# EAGLE design Jalousie_02 (EAGLE 4.16)
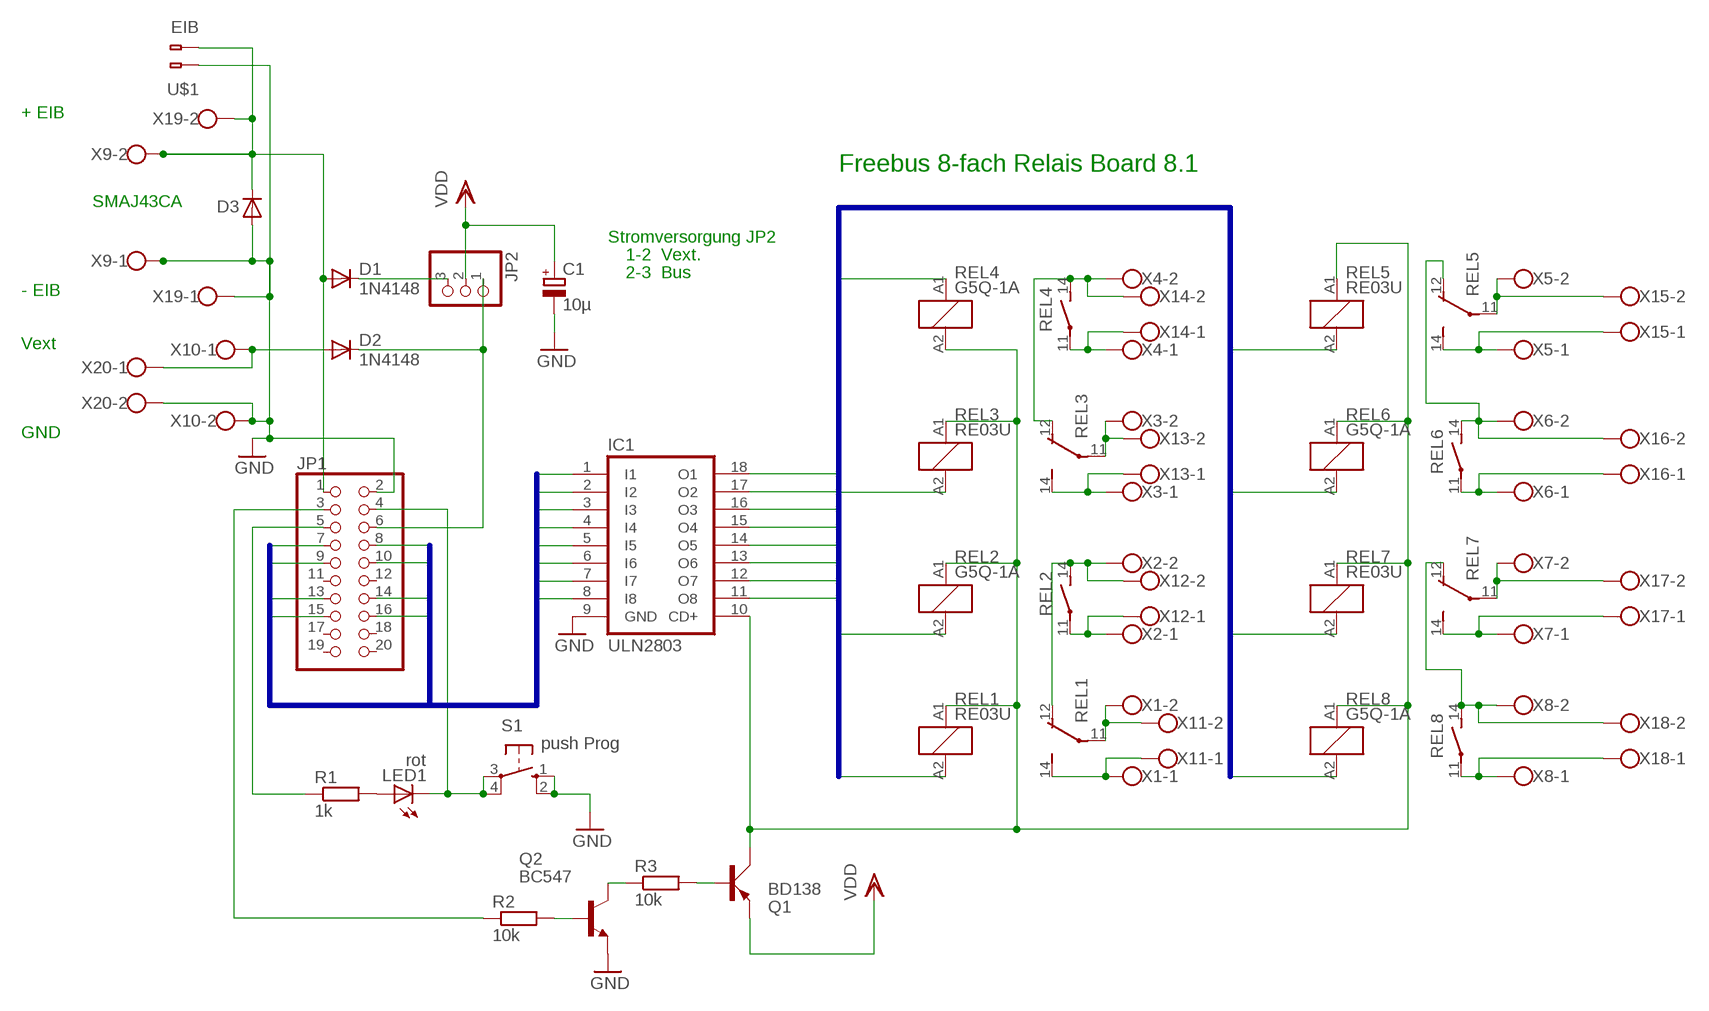
[diagram p0: schematic, sheet 1]

## Parts
C1  10µ  CPOL-EUE3.5-8  [E3,5-8]
D1  1N4148  [DO35-10]
D2  1N4148  [DO35-10]
D3  D-  [SMA]
IC1  ULN2803  ULN2803A  [DIL18]
JP1  PINHD-2X10  [2X10]
JP2  PINHD-1X3  [1X03]
LED1  rot  LED3MM  [LED3MM]
Q1  BD138  BD140  [TO126AV]
Q2  BC547  [TO92]
R1  1k  R-EU_0207/10  [0207/10]
R2  10k  R-EU_0207/10  [0207/10]
R3  10k  R-EU_0207/10  [0207/10]
REL1  RE03U  [G5Q_1_EU]
REL2  G5Q-1A  RE030024  [RE-SCHRACK]
REL3  RE03U  [G5Q_1_EU]
REL4  G5Q-1A  RE030024  [RE-SCHRACK]
REL5  RE03U  [G5Q_1_EU]
REL6  G5Q-1A  RE030024  [RE-SCHRACK]
REL7  RE03U  [G5Q_1_EU]
REL8  G5Q-1A  RE030024  [RE-SCHRACK]
S1  push Prog  10-XX  [B3F-10XX]
U$1  EIB  [BUSKLEMME243-724]
X1  W237-102W2POL5_08  [W237-132]
X2  W237-102W2POL5_08  [W237-132]
X3  W237-102W2POL5_08  [W237-132]
X4  W237-102W2POL5_08  [W237-132]
X5  W237-102W2POL5_08  [W237-132]
X6  W237-102W2POL5_08  [W237-132]
X7  W237-102W2POL5_08  [W237-132]
X8  W237-102W2POL5_08  [W237-132]
X9  W237-102W2POL5_08  [W237-132]
X10  W237-102W2POL5_08  [W237-132]
X11  W237-102AKL007-2P  [AKL007-02]
X12  W237-102AKL007-2P  [AKL007-02]
X13  W237-102AKL007-2P  [AKL007-02]
X14  W237-102AKL007-2P  [AKL007-02]
X15  W237-102AKL007-2P  [AKL007-02]
X16  W237-102AKL007-2P  [AKL007-02]
X17  W237-102AKL007-2P  [AKL007-02]
X18  W237-102AKL007-2P  [AKL007-02]
X19  W237-102AKL007-2P  [AKL007-02]
X20  W237-102AKL007-2P  [AKL007-02]

## Nets
GND: C1.- D3.2(A) IC1.9(GND) JP1.2 Q2.1(E) S1.1(S) S1.2(S1) U$1.1(B-1) X9.1 X10.2 X19.1 X20.2
IO1: IC1.1(I1) JP1.16
IO2: IC1.2(I2) JP1.15
IO3: IC1.3(I3) JP1.14
IO4: IC1.4(I4) JP1.13
IO5: IC1.5(I5) JP1.10
IO6: IC1.6(I6) JP1.9
IO7: IC1.7(I7) JP1.8
IO8: IC1.8(I8) JP1.7
N$1: REL4.11(2:P) X4.1 X14.1
N$2: REL3.12(14:O) REL4.14(2:S) X4.2 X14.2
N$3: REL3.14(14:S) X3.1 X13.1
N$4: REL3.11(14:P) X3.2 X13.2
N$5: REL2.11(2:P) X2.1 X12.1
N$6: REL1.12(14:O) REL2.14(2:S) X2.2 X12.2
N$7: REL1.14(14:S) X1.1 X11.1
N$8: REL1.11(14:P) X1.2 X11.2
N$9: REL5.12(14:O) REL6.14(2:S) X6.2 X16.2
N$10: REL6.11(2:P) X6.1 X16.1
N$11: REL7.11(14:P) X7.2 X17.2
N$12: REL8.11(2:P) X8.1 X18.1
N$13: REL5.11(14:P) X5.2 X15.2
N$14: REL5.14(14:S) X5.1 X15.1
N$15: REL7.14(14:S) X7.1 X17.1
N$16: REL7.12(14:O) REL8.14(2:S) X8.2 X18.2
N$17: D2.A X10.1 X20.1
N$19: IC1.10(CD+) Q1.C REL1.A1 REL2.A1 REL3.A1 REL4.A2 REL5.A1 REL6.A1 REL7.A1 REL8.A1
N$20: D1.A D3.1(C) JP1.1 U$1.2(B-2) X9.2 X19.2
N$24: JP1.5 R1.1
N$27: JP1.4 LED1.K(C) S1.3(P) S1.4(P1)
N$28: LED1.A R1.2
N$31: D2.C JP1.6 JP2.1
N$32: D1.C JP2.3
N$33: JP1.3 R2.1
N$37: Q1.B R3.2
N$38: Q2.3(C) R3.1
N$39: Q2.2(B) R2.2
R1: IC1.14(O5) REL4.A1
R2: IC1.13(O6) REL3.A2
R3: IC1.12(O7) REL2.A2
R4: IC1.11(O8) REL1.A2
R5: IC1.15(O4) REL5.A2
R6: IC1.16(O3) REL6.A2
R7: IC1.17(O2) REL7.A2
R8: IC1.18(O1) REL8.A2
VDD: C1.+ JP2.2 Q1.E
Unconnected: JP1.11 JP1.12 JP1.17 JP1.18 JP1.19 JP1.20

## Buses
R[1..8]
IO[1..8]

## Notes on the sheet
- + EIB
- Freebus 8-fach Relais Board 8.1
- SMAJ43CA
- Stromversorgung JP2
- 1-2  Vext.
- 2-3  Bus
- - EIB
- Vext
- GND

## Library data of the parts
C1 = rcl:CPOL-EU: POLARIZED CAPACITOR, European symbol
D1 D2 = diode:1N4148: DIODE high speed (Philips)
D3 = semicon-smd-ipc:D-: DIODE unfilled
IC1 = uln-udn:ULN2803A: DRIVER ARRAY
JP1 = pinhead:PINHD-2X10: PIN HEADER
JP2 = pinhead:PINHD-1X3: PIN HEADER
LED1 = led:LED: LED OSRAM: - CHIPLED LG R971, LG N971, LY N971, LG Q971, LY Q971, LO R971, LY R971 LH N974, LH R974 LS Q976, LO Q976, LY Q976 LO Q996 - Hyper CHIPLED LW Q18S LB Q993, LB Q99A, LB R99A - SideLED LS A670, LO A670, LY A670, LG A670, LP A670 LB A673, LV A673, LT A673, LW A673 LH A674 LY A675 LS A676, LA A676, LO A676, LY A676, LW A676 LS A679, LY A679, LG A679 - Hyper Micro SIDELED® LS Y876, LA Y876, LO Y876, LY Y876 LT Y87S - SmartLED LW L88C, LW L88S LB L89C, LB L89S, LG L890 LS L89K, LO L89K, LY L89K LS L896, LA L896, LO L896, LY L896 - TOPLED LS T670, LO T670, LY T670, LG T670, LP T670 LSG T670, LSP T670, LSY T670, LOP T670, LYG T670 LG T671, LOG T671, LSG T671 LB T673, LV T673, LT T673, LW T673 LH T674 LS T676, LA T676, LO T676, LY T676, LB T676, LH T676, LSB T676, LW T676 LB T67C, LV T67C, LT T67C, LS T67K, LO T67K, LY T67K, LW E67C LS E67B, LA E67B, LO E67B, LY E67B, LB E67C, LV E67C, LT E67C LW T67C LS T679, LY T679, LG T679 LS T770, LO T770, LY T770, LG T770, LP T770 LB T773, LV T773, LT T773, LW T773 LH T774 LS E675, LA E675, LY E675, LS T675 LS T776, LA T776, LO T776, LY T776, LB T776 LHGB T686 LT T68C, LB T68C - Hyper Mini TOPLED® LB M676 - Mini TOPLED Santana® LG M470 LS M47K, LO M47K, LY M47K Source: http://www.osram.convergy.de - LUMILED® LXK2-PW12-R00, LXK2-PW12-S00, LXK2-PW14-U00, LXK2-PW14-V00 LXK2-PM12-R00, LXK2-PM12-S00, LXK2-PM14-U00 LXK2-PE12-Q00, LXK2-PE12-R00, LXK2-PE12-S00, LXK2-PE14-T00, LXK2-PE14-U00 LXK2-PB12-K00, LXK2-PB12-L00, LXK2-PB12-M00, LXK2-PB14-N00, LXK2-PB14-P00, LXK2-PB14-Q00 LXK2-PR12-L00, LXK2-PR12-M00, LXK2-PR14-Q00, LXK2-PR14-R00 LXK2-PD12-Q00, LXK2-PD12-R00, LXK2-PD12-S00 LXK2-PH12-R00, LXK2-PH12-S00 LXK2-PL12-P00, LXK2-PL12-Q00, LXK2-PL12-R00 Source: www.luxeon.com
Q1 = transistor-power:BD140: PNP TRANSISTOR
Q2 = transistor-npn:BC547*: NPN Transistor
R1-R3 = rcl:R-EU_: RESISTOR, European symbol
REL1 REL3 REL5 REL7 = freebus_relay:RE03U
REL2 REL4 REL6 REL8 = relay:RE03*: Miniature PCB Relay 1 pole 6 A SCHRACK Source: http://www.schrack.com/.. 5812.pdf
S1 = switch-omron:10-XX: OMRON SWITCH
U$1 = con-wago:EIB
X1-X20 = con-wago-500:W237-102: WAGO SCREW CLAMP

## Board
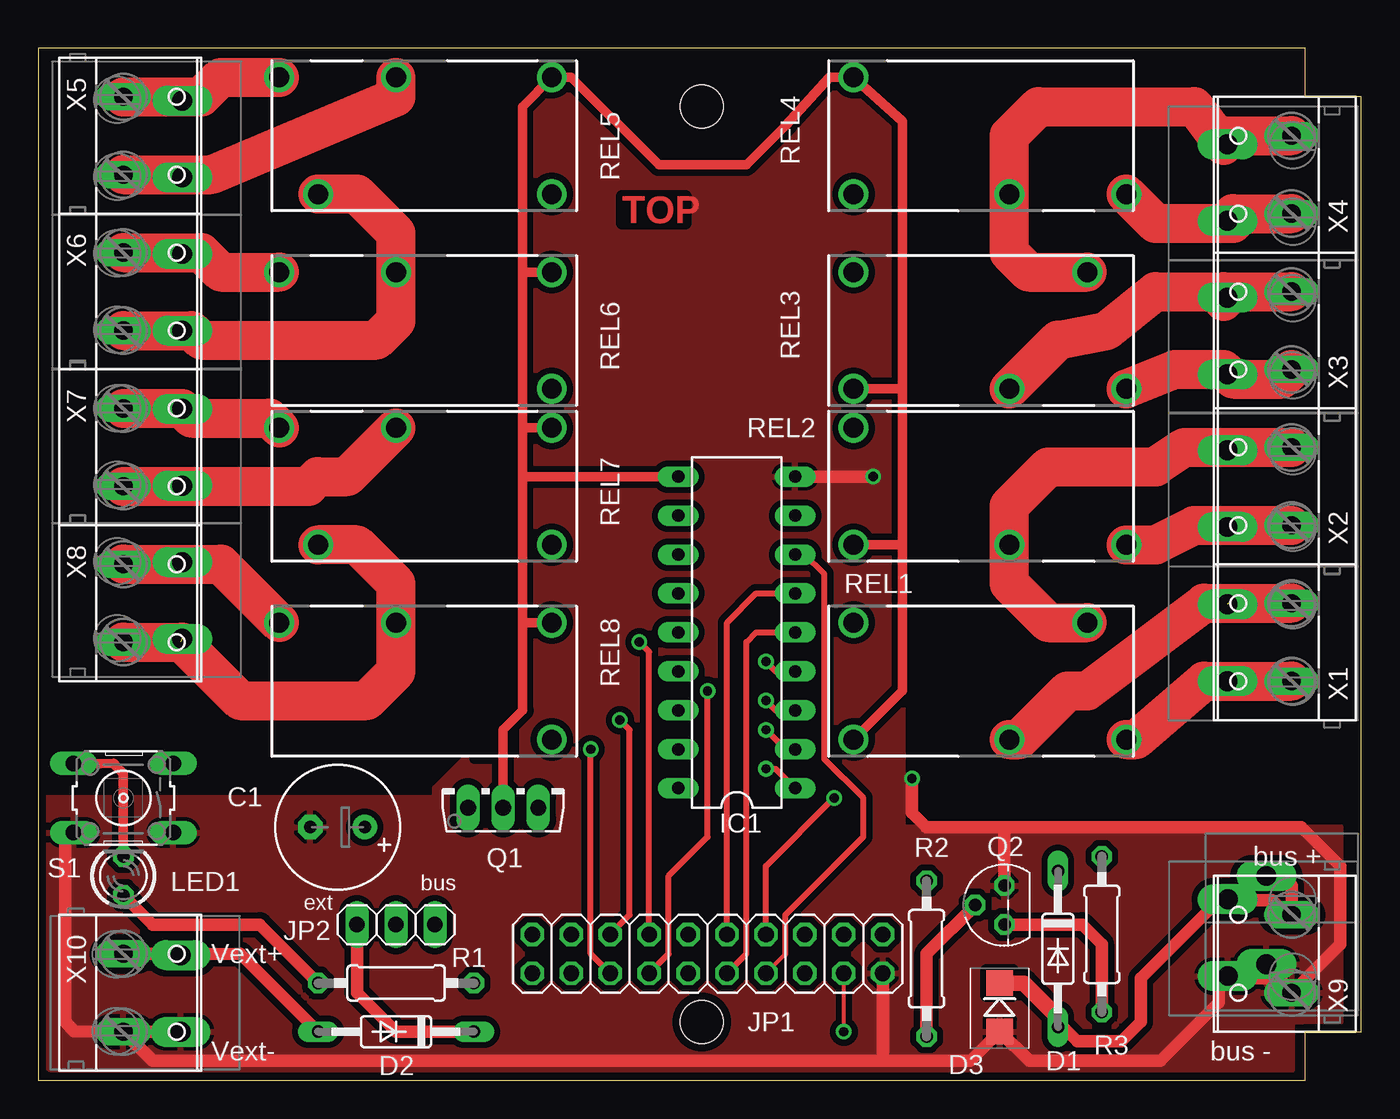
[diagram p1: board, top side]
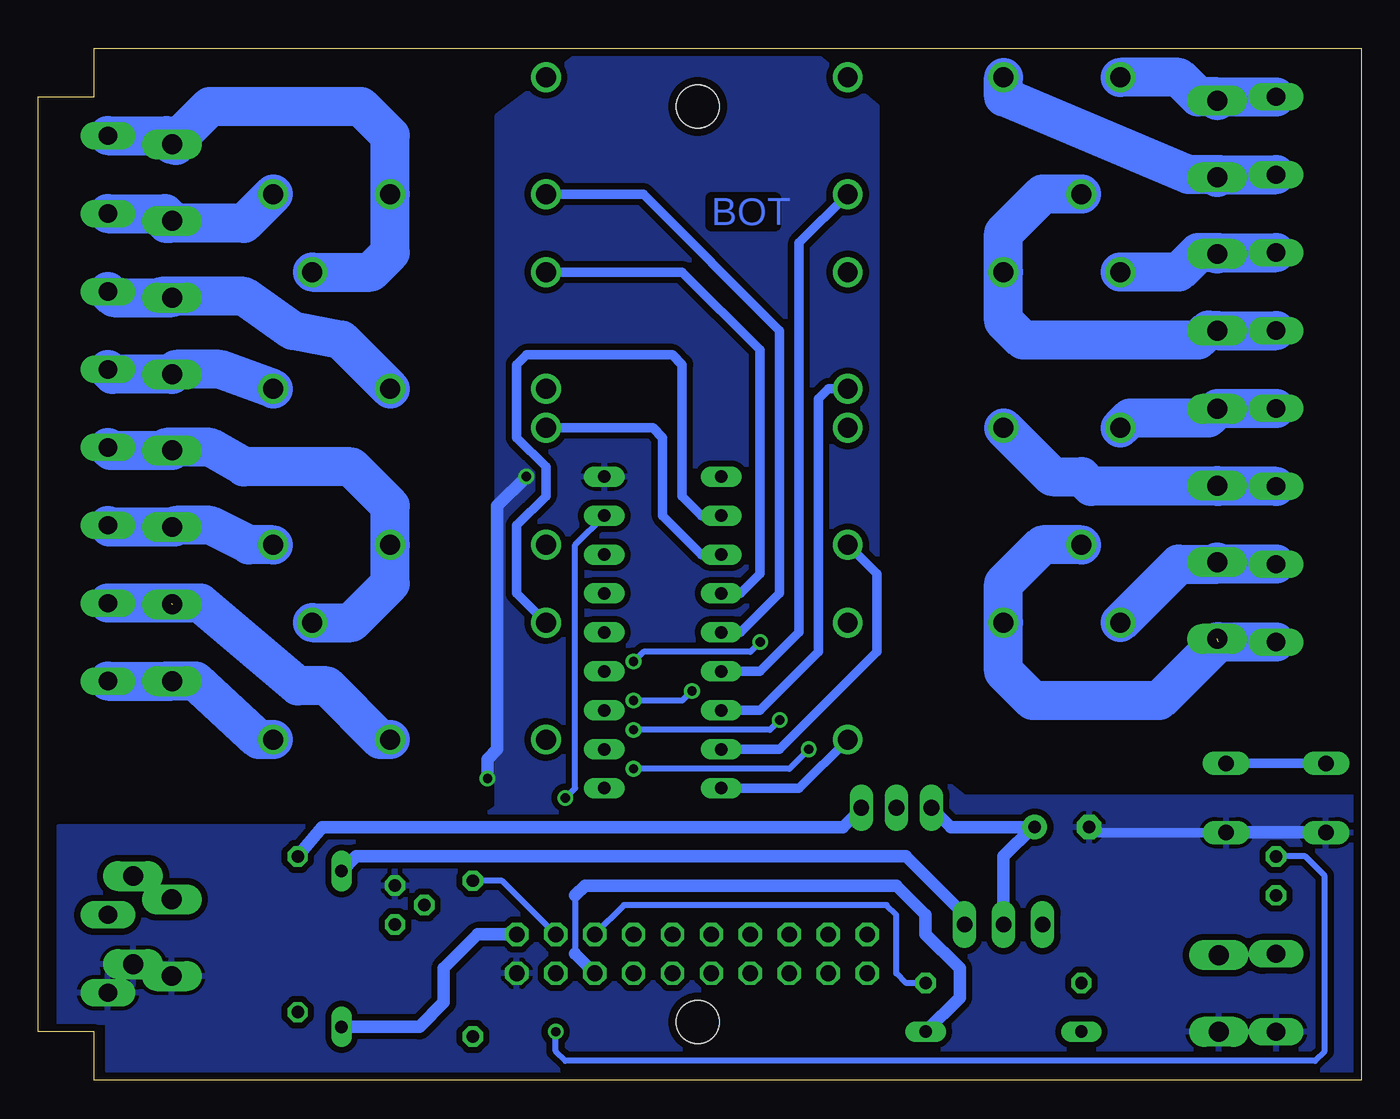
[diagram p2: board, bottom side, seen from below]

Size 86.28 x 67.31 mm. Coordinates in mm from the lower left corner, seen from the top.
Outline: 0,0.01 82.64,0 82.64,3.18 86.28,3.18 86.28,64.13 82.64,64.13 82.64,67.31 0,67.31 0,0.01
Copper layers (1*16): Top 0.035mm / dielectric 1.5mm / Bottom 0.035mm
Design rules "default": minimum track width 10mil, minimum drill 24mil, track to track 16mil, track to pad 12mil, pad to pad 16mil, via to via 16mil, smd to smd 8mil, copper to edge 20mil, drill to drill 10mil, minimum pad ring 10mil, minimum via ring 8mil, stop-mask expansion 4mil, vias tented up to drill 0mil, thermal gap 10mil
Holes 2.8 mm at 43.27,3.81 43.27,63.5
tRestrict: area 28.4,21 to 29.7,67.9; area 57,22.2 to 58.3,69.2
bRestrict: area 57,22.2 to 58.3,69.2; area 28.4,21 to 29.7,67.9

### Footprints (pad centres in the part's own frame; a part is rotated, then mirrored left to right if it is on the bottom)
E3,5-8 = drill 0.813 pad 1.6 round: + -1.778,0 | drill 0.813 pad 1.6 octagon: - 1.778,0
DO35-10 = drill 0.813 long: A 5.08,0; C -5.08,0
SMA = smd 1.67 x 1.73: 1 -1.576,0; 2 1.58,0.014
DIL18 = drill 0.813 long: 1 -10.16,-3.81; 2 -7.62,-3.81; 3 -5.08,-3.81; 4 -2.54,-3.81; 5 0,-3.81; 6 2.54,-3.81; 7 5.08,-3.81; 8 7.62,-3.81; 9 10.16,-3.81; 10 10.16,3.81; 11 7.62,3.81; 12 5.08,3.81; 13 2.54,3.81; 14 0,3.81; 15 -2.54,3.81; 16 -5.08,3.81; 17 -7.62,3.81; 18 -10.16,3.81
2X10 = drill 1.016 octagon: 1 -11.43,-1.27; 2 -11.43,1.27; 3 -8.89,-1.27; 4 -8.89,1.27; 5 -6.35,-1.27; 6 -6.35,1.27; 7 -3.81,-1.27; 8 -3.81,1.27; 9 -1.27,-1.27; 10 -1.27,1.27; 11 1.27,-1.27; 12 1.27,1.27; 13 3.81,-1.27; 14 3.81,1.27; 15 6.35,-1.27; 16 6.35,1.27; 17 8.89,-1.27; 18 8.89,1.27; 19 11.43,-1.27; 20 11.43,1.27
1X03 = drill 1.016 long: 1 -2.54,0; 2 0,0; 3 2.54,0
LED3MM = drill 0.813 octagon: A -1.27,0; K 1.27,0
TO126AV = drill 1.016 long: B 2.286,-1.27; C 0,-1.27; E -2.286,-1.27
TO92 = drill 0.813 octagon: 1 1.27,0; 2 0,1.905; 3 -1.27,0
0207/10 = drill 0.813 octagon: 1 -5.08,0; 2 5.08,0
G5Q_1_EU = drill 1.3 round: 11 1.27,-3.81; 12 6.35,3.81; 14 8.89,-3.81; A1 -8.89,-3.81; A2 -8.89,3.81
RE-SCHRACK = drill 1.3 round: 11 8.89,-3.81; 14 1.27,-3.81; A1 -8.89,-3.81; A2 -8.89,3.81
B3F-10XX = drill 1.016 long: 1 -3.251,2.261; 2 3.251,2.261; 3 -3.251,-2.261; 4 3.251,-2.261
BUSKLEMME243-724 = drill 1.3 long: 1 -2.875,0; 2 2.875,0
W237-132 = drill 1.194 long: 1 -2.54,-0.635; 2 2.54,-0.635
AKL007-02 = drill 1.3 long: 1 -2.45,2.325; 2 2.55,2.325

### Placement (x,y rotation side)
C1  19.52,16.51 180 top
D1  66.51,8.57 270 top
D2  23.33,3.17 180 top
D3  62.7,4.76 270 top
IC1  45.55,29.21 90 top
JP1  43.65,8.26 180 top
JP2  23.33,10.16 0 top
LED1  5.55,13.33 90 top
Q1  30.31,19.05 0 top
Q2  63.02,11.43 90 top
R1  23.33,6.35 180 top
R2  57.94,7.94 270 top
R3  69.37,9.53 90 top
REL1  62.06,26.04 0 top
REL2  62.06,38.73 0 top
REL3  62.06,48.89 0 top
REL4  62.06,61.59 0 top
REL5  24.6,61.59 180 top
REL6  24.6,48.89 180 top
REL7  24.6,38.73 180 top
REL8  24.6,26.04 180 top
S1  5.55,18.42 180 top
U$1  80.11,10.45 90 top
X1  81.11,28.58 90 top
X2  81.11,38.73 90 top
X3  81.11,48.89 90 top
X4  81.11,59.05 90 top
X5  6.18,61.59 270 top
X6  6.18,51.43 270 top
X7  6.18,41.27 270 top
X8  6.18,31.12 270 top
X9  81.11,8.26 90 top
X10  6.18,5.71 270 top
X11  79.89,28.49 90 top
X12  79.89,38.53 90 top
X13  79.89,48.49 90 top
X14  79.89,58.49 90 top
X15  7.07,61.43 270 top
X16  7.07,51.43 270 top
X17  7.07,41.34 270 top
X18  7.07,31.34 270 top
X19  79.9,9.25 90 top
X20  6.96,5.71 270 top

### Tracks (layer width: path | path; a pad name or v marks a point on that pad's centre or on a via)
GND  (via drill 0.61)
  Top 0.406: D3.2
  Top 0.61: 2.02,16.15 S1.2
  Top 0.813: 55.08,1.27 7.46,1.27 X10.2 | 55.08,1.27 60.8,1.27 D3.2 | 2.02,16.15 1.74,15.88 1.74,3.81 2.33,3.21 X10.2 | 63.02,16.51 82.39,16.51 84.92,13.97 84.92,8.89 X9.1 | 63.02,16.51 Q2.1 | 55.08,1.27 JP1.2 | v56.98,19.69 56.98,17.46 57.94,16.51 63.02,16.51 | v54.45,39.37 IC1.9 | 77.07,6.83 77.07,6.81 X19.1 76.99,6.72 76.99,6.67 | X9.1 80.8,6.67 76.99,6.67 | D3.2 64.63,1.27 73.18,1.27 76.99,5.08 76.99,6.67 | X20.2 9.28,3.17 X10.2 | U$1.1 80.48,7.2 X9.1
  Bottom 0.61: C1.- 17.61,16.51 17.61,16.15 S1.1 | S1.2 arc-11 2.38,16.19
  Bottom 0.813: v54.45,39.37 56.35,37.46 56.35,21.59 56.98,20.96 v56.98,19.69 | S1.1 8.76,16.19 2.38,16.19
  pour Bottom (isolate 0.305): 0.47,18.42 25.87,18.42 29.04,20.96 31.58,20.96 31.58,63.5 35.39,66.68 51.27,66.68 56.35,62.86 56.35,17.78 58.25,16.51 84.92,16.51 84.92,3.81 81.75,3.81 81.75,0.64 0.47,0.64
  pour Top (isolate 0.305): 0.47,18.42 25.87,18.42 25.87,19.05 27.77,20.96 31.58,20.96 31.58,63.5 34.76,66.68 51.91,66.68 52.54,66.68 56.35,62.86 56.35,16.51 84.92,16.51 84.92,3.81 81.75,3.81 81.75,0.64 1.1,0.64 arc-90 0.47,1.27
IO1  (via drill 0.61)
  Top 0.406: IC1.1 48.09,20.32 v47.46,20.32 | JP1.16 36.03,8.26 v36.03,21.59
  Bottom 0.406: v47.46,20.32 37.3,20.32 v36.03,21.59
IO2  (via drill 0.61)
  Top 0.406: JP1.15 38.57,10.79 38.57,22.86 v37.94,23.5 | IC1.2 48.73,21.59 v47.46,22.86
  Bottom 0.406: v47.46,22.86 38.57,22.86 v37.94,23.5
IO3  (via drill 0.61)
  Top 0.406: JP1.14 41.11,8.26 41.11,13.33 43.65,15.88 v43.65,25.4 | IC1.3 48.09,24.13 v47.46,24.77
  Bottom 0.406: v43.65,25.4 44.28,24.77 v47.46,24.77
IO4  (via drill 0.61)
  Top 0.406: JP1.13 39.84,27.94 v39.2,28.58 | IC1.4 48.09,26.67 v47.46,27.31
  Bottom 0.406: v39.2,28.58 39.84,27.94 46.82,27.94 v47.46,27.31
IO5
  Top 0.406: JP1.10 46.19,8.26 46.19,28.58 46.82,29.21 IC1.5
IO6
  Top 0.406: JP1.9 44.92,29.85 46.82,31.75 IC1.6
IO7
  Top 0.254: JP1.8 48.73,8.26
  Top 0.406: 48.73,8.26 48.73,10.79 53.81,15.88 53.81,18.42 51.27,20.96 51.27,33.02 50,34.29 IC1.7
IO8  (via drill 0.61)
  Top 0.406: v51.91,18.42 47.46,13.97 JP1.7
  Bottom 0.406: IC1.8 51.27,34.92 51.27,19.05 v51.91,18.42
N$1
  Top 2.54: REL4.11 72.86,55.88 77.94,55.88 77.94,56.52 X4.1
  Bottom 2.54: 77.72,55.88 77.94,55.88 | 77.72,55.88 X14.1 78.04,56.52 X4.1 | REL4.11 72.86,55.88 77.72,55.88
N$2
  Top 2.54: REL3.12 64.61,52.7 63.34,53.98 63.34,61.59 65.24,63.5 75.4,63.5 77.3,60.96 77.3,61.59 X4.2
  Bottom 2.54: REL3.12 64.61,52.7 63.34,53.98 REL4.14 63.34,61.59 65.24,63.5 75.1,63.5 X14.2 77.38,61.04 arc90 77.3,60.96 arc-90 77.94,61.59 X4.2
N$3
  Top 2.54: REL3.14 74.13,46.35 77.3,46.35 77.94,45.72 81.11,45.72 X3.1
  Bottom 2.54: REL3.14 74.45,46.35 77.3,46.35 77.56,46.1 X13.1 81.43,46.04 X3.1
N$4
  Top 2.54: REL3.11 66.51,48.26 69.69,48.89 72.86,51.43 77.3,51.43 | 77.3,51.43 77.3,50.8 | 77.3,51.43 X3.2
  Bottom 2.54: 78.26,51.12 72.86,51.12 69.69,48.89 66.51,48.26 REL3.11 | X13.2 81.35,51.04 X3.2
N$5
  Top 2.54: REL2.11 72.86,34.92 75.4,36.2 X2.1
  Bottom 2.54: REL2.11 72.54,34.92 75.08,36.2 77.3,36.2 77.41,36.09 X12.1 81.64,36.09 X2.1
N$6
  Top 2.54: REL1.12 65.88,29.85 63.34,32.38 63.34,37.46 65.88,40 72.86,40 74.77,41.27 X2.2
  Bottom 2.54: REL1.12 65.88,29.85 63.34,32.38 REL2.14 63.34,37.46 65.88,40 72.86,40 75.08,41.27 77.94,41.27 77.75,41.09 X12.2 81.56,41.09 X2.2
N$7
  Top 2.54: REL1.14 71.59,22.23 76.03,26.04 X1.1
  Bottom 2.54: REL1.14 71.91,22.23 76.03,26.04 77.94,26.04 X11.1 X1.1
N$8  (1 unrouted)
  Top 2.54: REL1.11 63.97,22.23 67.14,25.4 68.41,25.4 76.03,31.12 X1.2
  Bottom 2.54: REL1.11 63.97,22.23 67.46,25.72 69.37,25.72 75.72,31.12 77.62,31.12 | 77.62,31.12 77.94,31.12 | 77.62,31.12 X1.2
N$9
  Top 2.54: REL5.12 20.79,57.78 23.33,55.24 23.33,49.53 22.06,48.26 10.63,48.26 10,48.89 X6.2
  Bottom 2.54: REL5.12 20.79,57.78 23.33,55.24 REL6.14 23.33,49.53 22.06,48.26 10.63,48.26 9.96,48.93 9.92,48.89 9.38,48.89 | 9.38,48.89 9.36,48.89 | X16.2 9.38,48.89 | 9.38,48.89 X6.2
N$10
  Top 2.54: REL6.11 11.9,52.7 10.63,53.98 X6.1
  Bottom 2.54: REL6.11 11.9,52.7 10.63,53.98 9.36,53.98 9.36,53.92 X16.1 9.31,53.98 X6.1
N$11
  Top 2.54: X7.2 17.61,38.73 18.25,39.37 20.15,39.37 REL7.11
  Bottom 2.54: REL7.11 20.15,39.37 18.25,39.37 17.61,38.73 9.36,38.73 9.36,38.75 X17.2 9.35,38.73 X7.2
N$12
  Top 2.54: X8.1 11.9,33.66 REL8.11
  Bottom 2.54: REL8.11 11.9,33.66 9.36,33.66 9.36,33.75 X18.1 9.27,33.66 X8.1
N$13
  Top 2.54: REL5.11 23.33,64.14 11.27,59.05 X5.2
  Bottom 2.54: REL5.11 23.33,64.14 11.27,59.05 9.36,59.05 9.36,58.92 X15.2 9.23,59.05 X5.2
N$14
  Top 2.54: X5.1 10.63,64.14 11.9,65.41 REL5.14
  Bottom 2.54: REL5.14 11.9,65.41 10.63,64.14 9.36,64.14 9.36,63.88 X15.1 9.15,64.14 X5.1
N$15
  Top 2.54: X7.1 9.36,43.81 10,43.18 15.08,43.18 REL7.14
  Bottom 2.54: REL7.14 15.08,43.18 10,43.18 9.36,43.81 9.37,43.81 | X17.1 9.37,43.81 | 9.37,43.81 X7.1
N$16  (1 unrouted)
  Top 2.54: X8.2 9.36,28.58 13.17,24.77 21.42,24.77 23.33,26.67 23.33,32.38 20.79,34.92 REL7.12
  Bottom 2.54: REL7.12 20.79,34.92 23.33,32.38 REL8.14 23.33,26.67 21.42,24.77 13.17,24.77 9.32,28.62 9.28,28.58 X8.2
N$17
  Top 0.813: 8.73,8.21 X10.1 9.2,8.26 X20.1 | 8.73,8.21 8.77,8.21 | 8.73,8.21 13.17,8.26 D2.A
N$19
  Top 0.61: 31.58,29.85 REL8.A1 | 31.58,39.37 IC1.10 | 31.58,29.85 31.58,39.37 | 31.58,39.37 31.58,42.54 | 31.58,42.54 REL7.A1 | 31.58,42.54 31.58,52.7 | 31.58,52.7 REL6.A1 | 31.58,52.7 31.58,63.5 REL5.A1 34.76,65.41 40.48,59.69 46.19,59.69 48.73,62.23 51.59,65.41 REL4.A2 56.35,62.55 56.35,45.09 | REL1.A1 56.35,25.4 56.35,34.92 | 56.35,34.92 REL2.A1 | 56.35,45.09 56.35,34.92 | 56.35,45.09 REL3.A1 | Q1.C 30.31,22.86 31.58,24.13 31.58,29.85
N$20
  Top 0.406: 63.64,6.34 D3.1
  Top 0.813: 77.07,11.81 77.07,11.83 | 77.07,11.81 X19.2 77.02,11.75 | 77.02,11.75 76.99,11.75 | 77.02,11.75 80.48,11.75 81.43,10.79 X9.2 81.75,12.7 81.12,13.33 | 77.07,11.81 71.91,6.65 71.91,3.81 70.64,2.54 67.78,2.54 66.83,3.49 D1.A | 81.12,13.33 81.11,13.33 | 81.12,13.33 U$1.2
  Top 1.016: 63.64,6.34 64.29,6.35 66.51,4.13 D1.A
  Bottom 0.813: D1.A 61.43,3.49 59.84,5.08 59.84,7.3 57.62,9.53 JP1.1
N$24
  Bottom 0.406: JP1.5 48.09,11.43 30.95,11.43 30.31,10.79 30.31,6.98 29.68,6.35 R1.1
N$27  (via drill 0.61)
  Top 0.254: v52.54,3.17 JP1.4
  Top 0.61: S1.4 arc7 4.92,20.67 arc6 5.55,20 LED1.K
  Bottom 0.406: LED1.K 3.64,14.61 2.38,13.33 2.38,1.91 3.01,1.27 51.91,1.27 52.54,1.91 v52.54,3.17
  Bottom 0.61: S1.4 S1.3
N$28
  Top 0.813: LED1.A 7.46,10.16 14.44,10.16 R1.2
N$31
  Top 0.813: D2.C 23.33,3.17 20.79,5.71 JP2.1
  Bottom 0.406: 51.27,12.06 51.27,8.26
  Bottom 0.813: 51.27,12.06 50.63,12.7 30.31,12.7 28.41,10.79 28.41,9.53 26.19,7.3 26.19,5.4 D2.C | 51.27,8.26 JP1.6
N$32
  Bottom 0.813: D1.C 65.56,14.61 29.68,14.61 25.87,10.79 JP2.3
N$33
  Bottom 0.406: R2.1 56.03,13.02 JP1.3
N$37
  Bottom 0.813: R3.2 67.78,16.51 33.81,16.51 32.54,17.78 Q1.B
N$38
  Top 0.813: Q2.3 68.1,10.16 69.37,8.89 R3.1
N$39
  Top 0.813: Q2.2 57.94,8.26 R2.2
R1
  Bottom 0.61: IC1.14 40.48,29.21 37.94,31.75 37.94,48.89 46.82,57.78 REL4.A1
R2
  Bottom 0.61: IC1.13 40.48,31.75 39.2,33.02 39.2,47.62 44.28,52.7 REL3.A2
R3
  Bottom 0.61: IC1.12 43.02,34.29 45.55,36.83 45.55,41.91 46.19,42.54 REL2.A2
R4
  Bottom 0.61: IC1.11 43.02,36.83 44.28,38.1 44.28,46.67 44.92,47.31 54.45,47.31 55.08,46.67 55.08,41.91 53.17,40 53.17,38.1 55.08,36.2 55.08,31.75 REL1.A2
R5
  Bottom 0.61: IC1.15 39.2,26.67 36.66,29.21 36.66,54.61 REL5.A2
R6
  Bottom 0.61: IC1.16 39.2,24.13 35.39,27.94 35.39,44.45 34.76,45.09 REL6.A2
R7
  Bottom 0.61: IC1.17 37.94,21.59 31.58,27.94 31.58,33.02 REL7.A2
R8
  Bottom 0.61: IC1.18 36.66,19.05 REL8.A2
VDD
  Bottom 0.813: Q1.E 26.76,16.51 21.42,16.51 | 21.42,16.51 C1.+ | JP2.2 23.33,14.61 21.42,16.51

### Text on the board
Top: TOP
Bottom: BOT
tPlace: bus + | bus | ext | Vext+ | Vext- | bus -
tValues: Jalousie_01